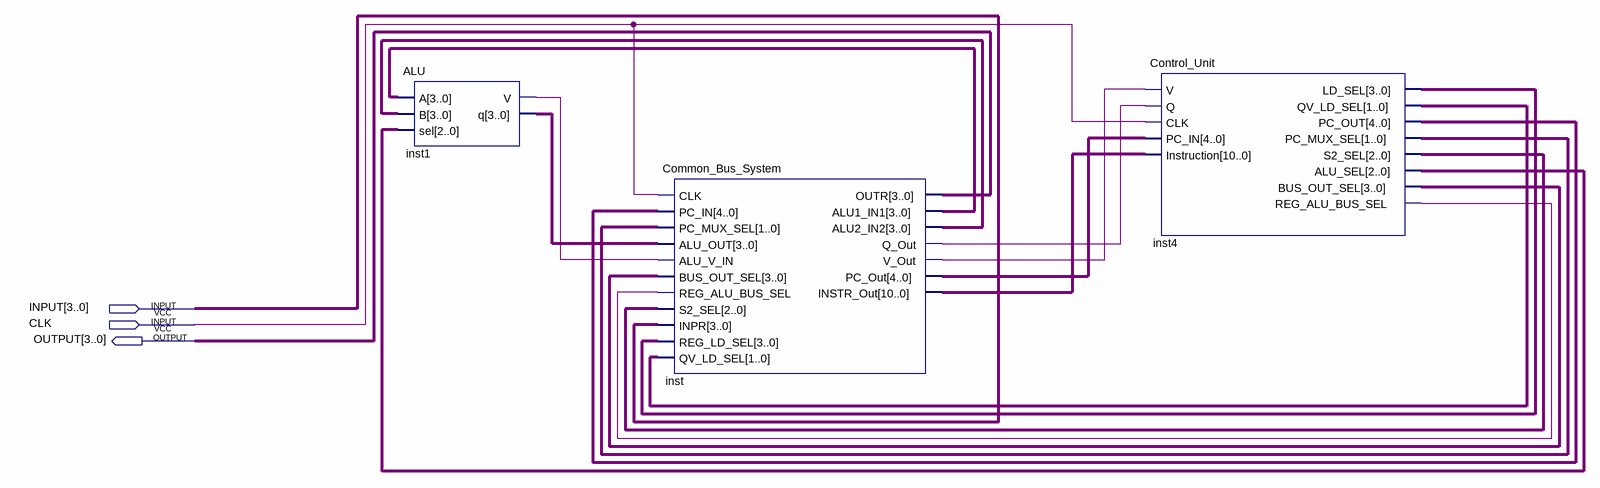
[diagram p0: schematic sheet]
// Quartus schematic DEUARC.bdf as structural Verilog: 3 symbols, 3 pins
module DEUARC (
  input  [3:0] INPUT,
  input  CLK,
  output [3:0] OUTPUT
);

  wire inst1_v, inst4_reg_alu_bus_sel, inst_q_out, inst_v_out;
  wire [1:0] inst4_pc_mux_sel, inst4_qv_ld_sel;
  wire [2:0] inst4_alu_sel, inst4_s2_sel;
  wire [3:0] inst1_q, inst4_bus_out_sel, inst4_ld_sel, inst_alu1_in1, inst_alu2_in2;
  wire [4:0] inst4_pc_out, inst_pc_out;
  wire [10:0] inst_instr_out;

  ALU inst1 (.A(inst_alu1_in1), .B(inst_alu2_in2), .sel(inst4_alu_sel), .V(inst1_v), .q(inst1_q));
  Common_Bus_System inst (
    .CLK(CLK), .PC_IN(inst4_pc_out), .PC_MUX_SEL(inst4_pc_mux_sel), .ALU_OUT(inst1_q), .ALU_V_IN(inst1_v),
    .BUS_OUT_SEL(inst4_bus_out_sel), .REG_ALU_BUS_SEL(inst4_reg_alu_bus_sel), .S2_SEL(inst4_s2_sel),
    .INPR(INPUT), .REG_LD_SEL(inst4_ld_sel), .QV_LD_SEL(inst4_qv_ld_sel), .OUTR(OUTPUT),
    .ALU1_IN1(inst_alu1_in1), .ALU2_IN2(inst_alu2_in2), .Q_Out(inst_q_out), .V_Out(inst_v_out),
    .PC_Out(inst_pc_out), .INSTR_Out(inst_instr_out));
  Control_Unit inst4 (
    .V(inst_v_out), .Q(inst_q_out), .CLK(CLK), .PC_IN(inst_pc_out), .Instruction(inst_instr_out),
    .LD_SEL(inst4_ld_sel), .QV_LD_SEL(inst4_qv_ld_sel), .PC_OUT(inst4_pc_out), .PC_MUX_SEL(inst4_pc_mux_sel),
    .S2_SEL(inst4_s2_sel), .ALU_SEL(inst4_alu_sel), .BUS_OUT_SEL(inst4_bus_out_sel),
    .REG_ALU_BUS_SEL(inst4_reg_alu_bus_sel));
endmodule
